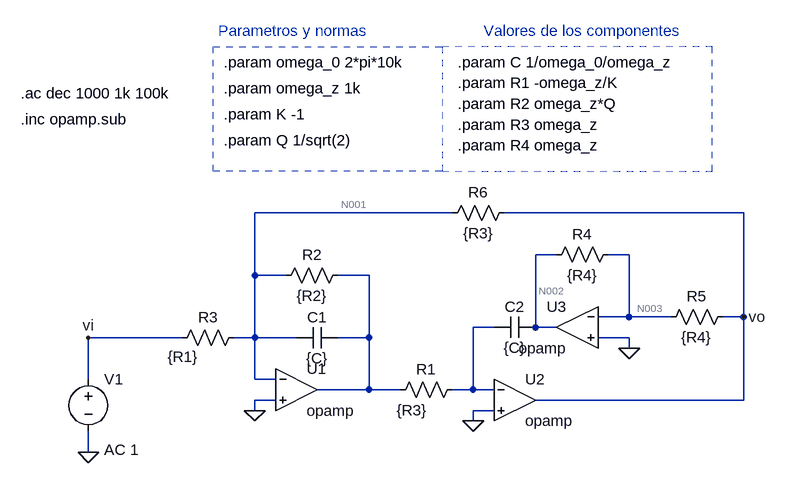
[diagram p0: schematic sim_lp.asc]
sim_lp.asc, the LTspice schematic file:
Version 4
SHEET 1 880 680
WIRE 224 -80 -80 -80
WIRE 672 -80 304 -80
WIRE 384 -16 352 -16
WIRE 496 -16 464 -16
WIRE -80 16 -80 -80
WIRE -32 16 -80 16
WIRE 96 16 48 16
WIRE 496 80 496 -16
WIRE 496 80 448 80
WIRE 560 80 496 80
WIRE 672 80 672 -80
WIRE 672 80 640 80
WIRE 288 96 256 96
WIRE 352 96 352 -16
WIRE 384 96 352 96
WIRE -192 112 -336 112
WIRE -80 112 -80 16
WIRE -80 112 -112 112
WIRE -16 112 -80 112
WIRE 96 112 96 16
WIRE 96 112 48 112
WIRE 496 112 448 112
WIRE 496 128 496 112
WIRE -336 176 -336 112
WIRE -80 176 -80 112
WIRE -48 176 -80 176
WIRE 96 192 96 112
WIRE 96 192 16 192
WIRE 144 192 96 192
WIRE 256 192 256 96
WIRE 256 192 224 192
WIRE 288 192 256 192
WIRE -48 208 -80 208
WIRE 672 208 672 80
WIRE 672 208 352 208
WIRE -80 224 -80 208
WIRE 288 224 256 224
WIRE 256 240 256 224
WIRE -336 288 -336 256
FLAG 256 240 0
FLAG -80 224 0
FLAG 496 128 0
FLAG -336 288 0
FLAG 672 80 vo
FLAG -336 112 vi
SYMBOL OpAmps\\opamp -16 128 R0
SYMATTR InstName U1
SYMATTR SpiceLine2 GBW=10G
SYMBOL OpAmps\\opamp 320 144 R0
SYMATTR InstName U2
SYMATTR SpiceLine2 GBW=10G
SYMBOL OpAmps\\opamp 416 32 M0
SYMATTR InstName U3
SYMATTR SpiceLine2 GBW=10G
SYMBOL res 240 176 R90
WINDOW 0 0 56 VBottom 2
WINDOW 3 32 78 VTop 2
SYMATTR InstName R1
SYMATTR Value {R3}
SYMBOL cap 48 96 R90
WINDOW 0 0 32 VBottom 2
WINDOW 3 32 32 VTop 2
SYMATTR InstName C1
SYMATTR Value {C}
SYMBOL res 64 0 R90
WINDOW 0 0 56 VBottom 2
WINDOW 3 32 56 VTop 2
SYMATTR InstName R2
SYMATTR Value {R2}
SYMBOL res -96 96 R90
WINDOW 0 0 56 VBottom 2
WINDOW 3 30 94 VTop 2
SYMATTR InstName R3
SYMATTR Value {R1}
SYMBOL cap 352 80 R90
WINDOW 0 0 32 VBottom 2
WINDOW 3 32 32 VTop 2
SYMATTR InstName C2
SYMATTR Value {C}
SYMBOL res 480 -32 R90
WINDOW 0 0 56 VBottom 2
WINDOW 3 32 56 VTop 2
SYMATTR InstName R4
SYMATTR Value {R4}
SYMBOL res 656 64 R90
WINDOW 0 0 56 VBottom 2
WINDOW 3 32 56 VTop 2
SYMATTR InstName R5
SYMATTR Value {R4}
SYMBOL voltage -336 160 R0
WINDOW 123 24 124 Left 2
WINDOW 39 0 0 Left 0
SYMATTR Value2 AC 1
SYMATTR InstName V1
SYMATTR Value ""
SYMBOL res 320 -96 R90
WINDOW 0 0 56 VBottom 2
WINDOW 3 32 56 VTop 2
SYMATTR InstName R6
SYMATTR Value {R3}
TEXT -128 -272 Left 2 !.param omega_z 1k
TEXT -128 -232 Left 2 !.param K -1
TEXT -128 -192 Left 2 !.param Q 1/sqrt(2)
TEXT -128 -312 Left 2 !.param omega_0 2*pi*10k
TEXT 232 -312 Left 2 !.param C 1/omega_0/omega_z
TEXT -440 -264 Left 2 !.ac dec 1000 1k 100k
TEXT -440 -224 Left 2 !.inc opamp.sub
TEXT 232 -280 Left 2 !.param R1 -omega_z/K
TEXT 232 -248 Left 2 !.param R2 omega_z*Q
TEXT 232 -216 Left 2 !.param R3 omega_z
TEXT 232 -184 Left 2 !.param R4 omega_z
TEXT 272 -360 Left 2 ;Valores de los componentes
TEXT -136 -360 Left 2 ;Parametros y normas
RECTANGLE Normal 624 -336 208 -144 2
RECTANGLE Normal 208 -144 -144 -336 2

The netlist it stands for:
* sim_lp.asc
XU1 N001 0 N004 opamp Aol=100K GBW=10G  ; pins invin noninvin out
XU2 N005 0 vo opamp Aol=100K GBW=10G  ; pins invin noninvin out
XU3 N003 0 N002 opamp Aol=100K GBW=10G  ; pins invin noninvin out
R1 N005 N004 {R3}
C1 N004 N001 {C}
R2 N004 N001 {R2}
R3 N001 vi {R1}
C2 N002 N005 {C}
R4 N003 N002 {R4}
R5 vo N003 {R4}
V1 vi 0 AC 1
R6 vo N001 {R3}
.param omega_z 1k
.param K -1
.param Q 1/sqrt(2)
.param omega_0 2*pi*10k
.param C 1/omega_0/omega_z
.ac dec 1000 1k 100k
.inc opamp.sub
.param R1 -omega_z/K
.param R2 omega_z*Q
.param R3 omega_z
.param R4 omega_z
* Valores de los componentes
* Parametros y normas
.backanno
.end

* Results of the author's LTspice run, read from the files saved beside the schematic
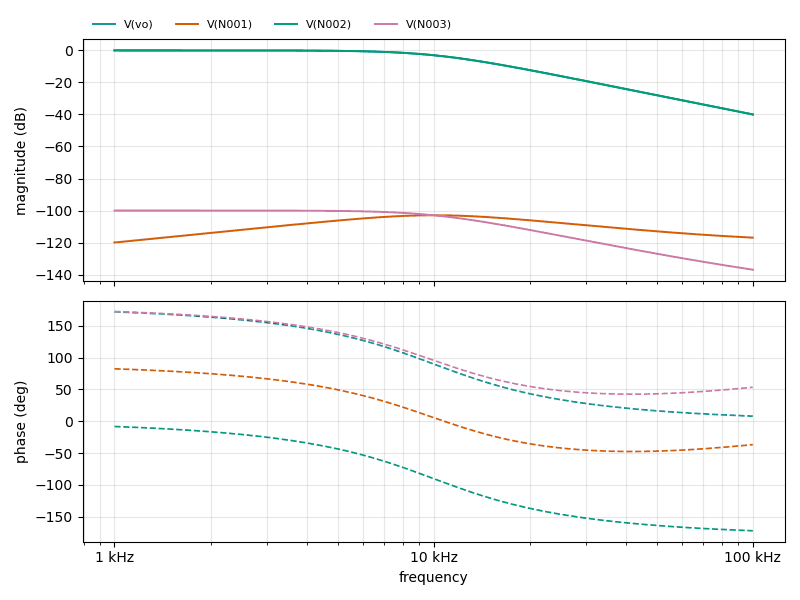
[diagram p1: AC Analysis of sim_lp.asc, plotted from the saved traces]
* AC Analysis, 1 run:
*   V(vo): -0.00 dB at 1 kHz, -40.00 dB at 100 kHz, peak -0.00 dB at 1 kHz, 3 dB below the peak at 10 kHz
*   V(N001): -119.98 dB at 1 kHz, -116.94 dB at 100 kHz, peak -102.95 dB at 10.05 kHz, 3 dB below the peak at 5.199 kHz and 19.63 kHz
*   V(N002): -0.00 dB at 1 kHz, -40.00 dB at 100 kHz, peak -0.00 dB at 1 kHz, 3 dB below the peak at 10 kHz
*   V(N003): -99.99 dB at 1 kHz, -136.94 dB at 100 kHz, peak -99.99 dB at 1 kHz, 3 dB below the peak at 10.05 kHz